# Altium schematic sheet PRUC-Voltmeter_FPGA-Unused.SchDoc: Voltmeter / FPGA Unused
size A4; SheetNumber: 7; SheetTotal: 9
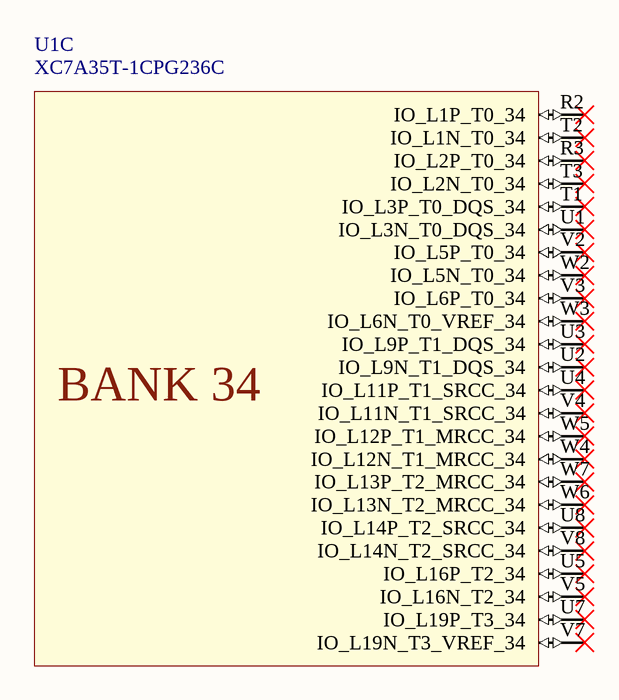
[diagram p0: PRUC-Voltmeter_FPGA-Unused.SchDoc]

## Parts
U1  XC7A35T-1CPG236C  [CPG236-0.5mm]  (part C of 8)

## Nets

Not connected (* = marked no-connect by the designer): U1 R2(IO_L1P_T0_34)* R3(IO_L2P_T0_34)* T1(IO_L3P_T0_DQS_34)* T2(IO_L1N_T0_34)* T3(IO_L2N_T0_34)* U1(IO_L3N_T0_DQS_34)* U2(IO_L9N_T1_DQS_34)* U3(IO_L9P_T1_DQS_34)* U4(IO_L11P_T1_SRCC_34)* U5(IO_L16P_T2_34)* U7(IO_L19P_T3_34)* U8(IO_L14P_T2_SRCC_34)* V2(IO_L5P_T0_34)* V3(IO_L6P_T0_34)* V4(IO_L11N_T1_SRCC_34)* V5(IO_L16N_T2_34)* V7(IO_L19N_T3_VREF_34)* V8(IO_L14N_T2_SRCC_34)* W2(IO_L5N_T0_34)* W3(IO_L6N_T0_VREF_34)* W4(IO_L12N_T1_MRCC_34)* W5(IO_L12P_T1_MRCC_34)* W6(IO_L13N_T2_MRCC_34)* W7(IO_L13P_T2_MRCC_34)*

## Notes on the sheet
- Project:
- Title:
- Variant Name:
- Author:
- Checked by:
- Ver/Rev:
- Date:
- Approved by:
- Sheet:
- of
- File name:
- (in symbol XC7A35T-1CPG236C, part C) BANK 34

## Library data of the parts
U1 = XC7A35T-1CPG236C: Manufacturer: Xilinx; Part Description: Xilinx 7 Series FPGA; Index: 159; Value: 33280 Cells; Part Number: XC7A35T-1CPG236C; SMD: true; Manufacturer Part Number: XC7A35T-1CPG236C; Supplier 1: Mouser; Supplier Part Number 1: 217-XC7A35T-1CPG236C; HelpURL: https://pl.mouser.com/datasheet/2/903/ds180_7Series_Overview-1591537.pdf; Category: FPGA